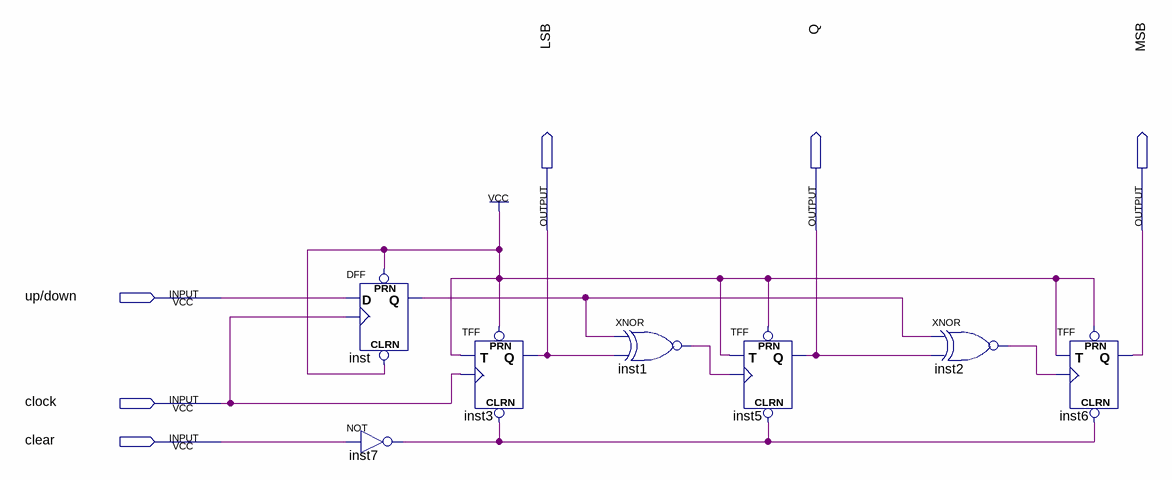
[diagram p0: schematic sheet]
// Quartus schematic up_and_down_counter_box.bdf as structural Verilog: 7 symbols, 6 pins
module up_and_down_counter_box (
  input  \up/down ,
  input  clock,
  input  clear,
  output LSB,
  output Q,
  output MSB
);

  wire inst1_out, inst2_out, inst7_out, inst_q;

  DFF inst (.CLRN(1'b1), .CLK(clock), .D(\up/down ), .PRN(1'b1), .Q(inst_q));
  not inst7 (inst7_out, clear);
  TFF inst3 (.PRN(1'b1), .CLRN(inst7_out), .T(1'b1), .CLK(clock), .Q(LSB));
  xnor inst1 (inst1_out, inst_q, LSB);
  TFF inst5 (.PRN(1'b1), .CLRN(inst7_out), .T(1'b1), .CLK(inst1_out), .Q(Q));
  xnor inst2 (inst2_out, inst_q, Q);
  TFF inst6 (.PRN(1'b1), .CLRN(inst7_out), .T(1'b1), .CLK(inst2_out), .Q(MSB));
endmodule
